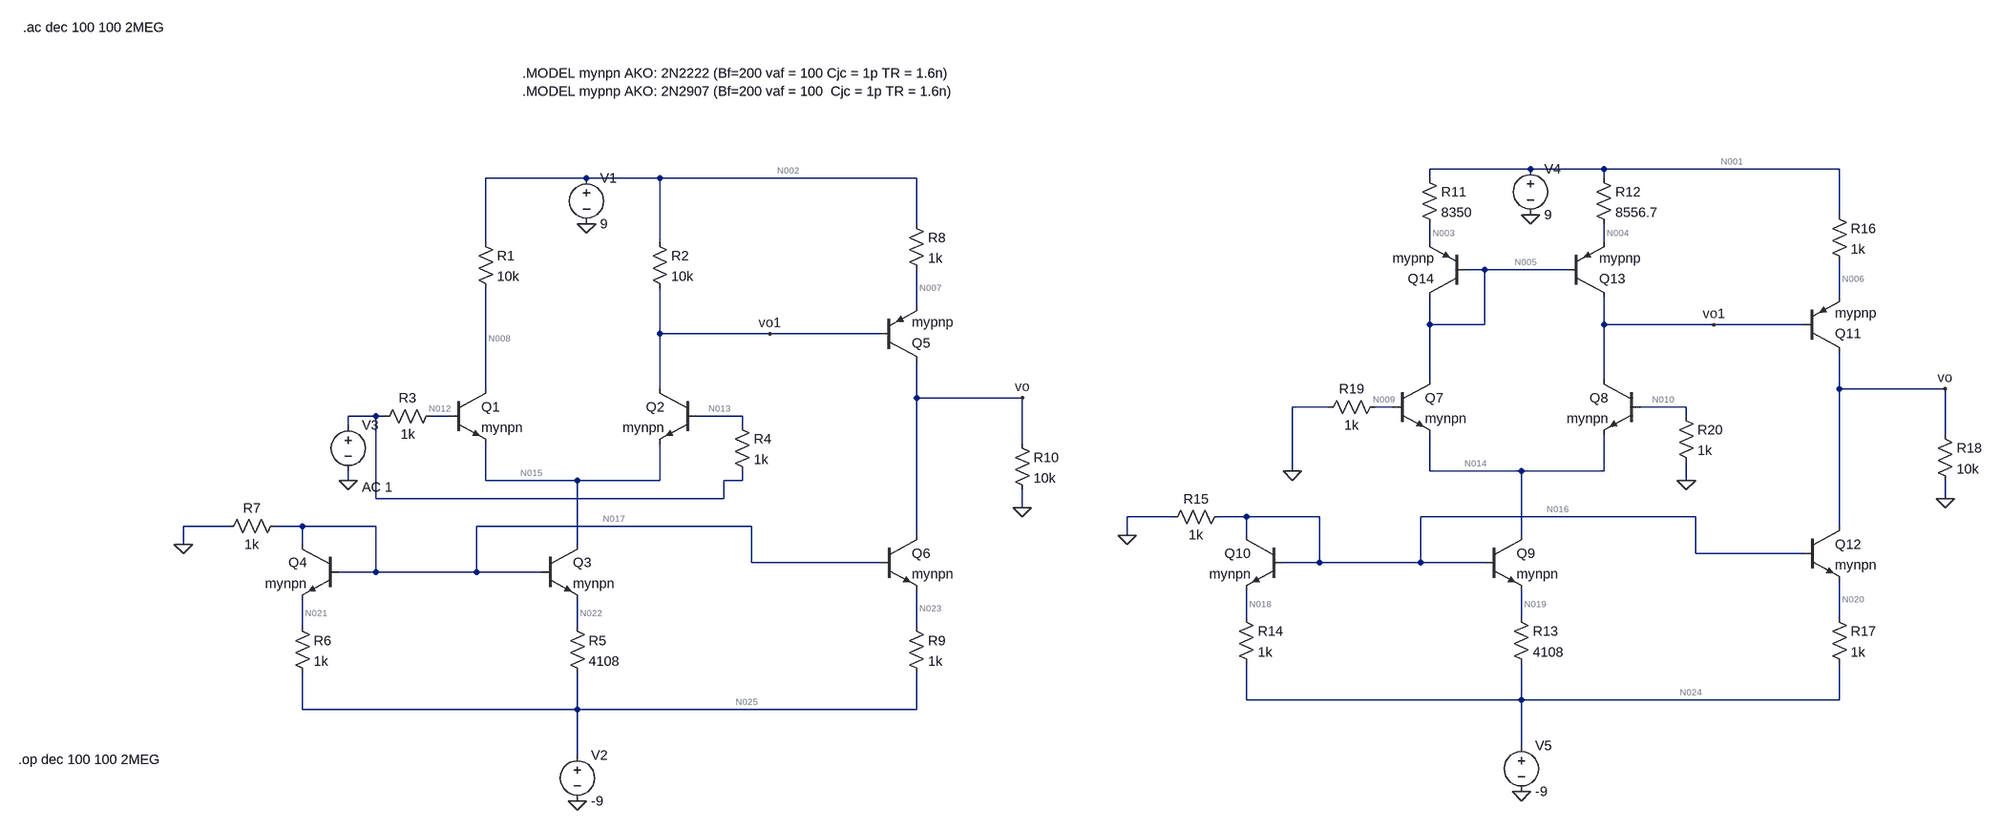
[diagram p0: schematic final que me tomaron.asc]
final que me tomaron.asc, the LTspice schematic file:
Version 4
SHEET 1 3460 1012
WIRE 2608 -112 2432 -112
WIRE 2736 -112 2608 -112
WIRE 3184 -112 2736 -112
WIRE 160 -96 -16 -96
WIRE 288 -96 160 -96
WIRE 736 -96 288 -96
WIRE 2432 -96 2432 -112
WIRE 2736 -96 2736 -112
WIRE 3184 -32 3184 -112
WIRE 736 -16 736 -96
WIRE -16 16 -16 -96
WIRE 288 16 288 -96
WIRE 2432 16 2432 -16
WIRE 2736 16 2736 -16
WIRE 2528 64 2496 64
WIRE 2672 64 2528 64
WIRE 3184 112 3184 48
WIRE 736 128 736 64
WIRE 2432 160 2432 112
WIRE 2528 160 2528 64
WIRE 2528 160 2432 160
WIRE 2736 160 2736 112
WIRE 2928 160 2736 160
WIRE 3120 160 2928 160
WIRE 288 176 288 96
WIRE 480 176 288 176
WIRE 672 176 480 176
WIRE 2432 256 2432 160
WIRE 2736 256 2736 160
WIRE -16 272 -16 96
WIRE 288 272 288 176
WIRE 3184 272 3184 208
WIRE 3392 272 3184 272
WIRE 736 288 736 224
WIRE 944 288 736 288
WIRE 2256 304 2192 304
WIRE 2368 304 2336 304
WIRE 2880 304 2800 304
WIRE -208 320 -256 320
WIRE -192 320 -208 320
WIRE -80 320 -112 320
WIRE 432 320 352 320
WIRE 2880 320 2880 304
WIRE -256 336 -256 320
WIRE 432 336 432 320
WIRE 3392 352 3392 272
WIRE 944 368 944 288
WIRE 2192 416 2192 304
WIRE 2432 416 2432 352
WIRE 2592 416 2432 416
WIRE 2736 416 2736 352
WIRE 2736 416 2592 416
WIRE -256 432 -256 416
WIRE -16 432 -16 368
WIRE 144 432 -16 432
WIRE 288 432 288 368
WIRE 288 432 144 432
WIRE 432 432 432 416
WIRE 432 432 400 432
WIRE 2880 432 2880 400
WIRE -208 464 -208 320
WIRE 400 464 400 432
WIRE 400 464 -208 464
WIRE 3392 464 3392 432
WIRE 944 480 944 448
WIRE 1984 496 1904 496
WIRE 2112 496 2064 496
WIRE 2240 496 2112 496
WIRE 2896 496 2416 496
WIRE -464 512 -544 512
WIRE -336 512 -384 512
WIRE -208 512 -336 512
WIRE 448 512 -32 512
WIRE 3184 512 3184 272
WIRE 736 528 736 288
WIRE 1904 528 1904 496
WIRE 2112 528 2112 496
WIRE 2592 528 2592 416
WIRE -544 544 -544 512
WIRE -336 544 -336 512
WIRE 144 544 144 432
WIRE 2896 560 2896 496
WIRE 3120 560 2896 560
WIRE 448 576 448 512
WIRE 672 576 448 576
WIRE 2240 576 2240 496
WIRE 2240 576 2176 576
WIRE 2416 576 2416 496
WIRE 2416 576 2240 576
WIRE 2528 576 2416 576
WIRE -208 592 -208 512
WIRE -208 592 -272 592
WIRE -32 592 -32 512
WIRE -32 592 -208 592
WIRE 80 592 -32 592
WIRE 2112 672 2112 624
WIRE 2592 672 2592 624
WIRE 3184 672 3184 608
WIRE -336 688 -336 640
WIRE 144 688 144 640
WIRE 736 688 736 624
WIRE 2112 816 2112 752
WIRE 2592 816 2592 752
WIRE 2592 816 2112 816
WIRE 3184 816 3184 752
WIRE 3184 816 2592 816
WIRE -336 832 -336 768
WIRE 144 832 144 768
WIRE 144 832 -336 832
WIRE 736 832 736 768
WIRE 736 832 144 832
WIRE 2592 896 2592 816
WIRE 144 912 144 832
FLAG 144 992 0
FLAG 160 -16 0
FLAG -544 544 0
FLAG 944 480 0
FLAG -256 432 0
FLAG 480 176 vo1
FLAG 944 288 vo
FLAG 2592 976 0
FLAG 2608 -32 0
FLAG 1904 528 0
FLAG 3392 464 0
FLAG 2192 416 0
FLAG 2880 432 0
FLAG 2928 160 vo1
FLAG 3392 272 vo
DATAFLAG 304 176 ""
DATAFLAG 736 288 ""
DATAFLAG 624 176 "$-V(N002)"
DATAFLAG 2752 160 ""
DATAFLAG 3184 272 ""
DATAFLAG 2432 144 ""
SYMBOL res -32 0 R0
SYMATTR InstName R1
SYMATTR Value 10k
SYMBOL res 272 0 R0
SYMATTR InstName R2
SYMATTR Value 10k
SYMBOL npn -80 272 R0
SYMATTR InstName Q1
SYMATTR Value mynpn
SYMBOL npn 352 272 M0
SYMATTR InstName Q2
SYMATTR Value mynpn
SYMBOL voltage 160 -112 R0
WINDOW 123 0 0 Left 0
WINDOW 39 0 0 Left 0
SYMATTR InstName V1
SYMATTR Value 9
SYMBOL npn 80 544 R0
SYMATTR InstName Q3
SYMATTR Value mynpn
SYMBOL res 128 672 R0
SYMATTR InstName R5
SYMATTR Value 4108
SYMBOL voltage 144 896 R0
WINDOW 123 0 0 Left 0
WINDOW 39 0 0 Left 0
SYMATTR InstName V2
SYMATTR Value -9
SYMBOL npn -272 544 M0
SYMATTR InstName Q4
SYMATTR Value mynpn
SYMBOL res -352 672 R0
SYMATTR InstName R6
SYMATTR Value 1k
SYMBOL res -368 496 R90
WINDOW 0 0 56 VBottom 2
WINDOW 3 32 56 VTop 2
SYMATTR InstName R7
SYMATTR Value 1k
SYMBOL pnp 672 224 M180
SYMATTR InstName Q5
SYMATTR Value mypnp
SYMBOL res 720 -32 R0
SYMATTR InstName R8
SYMATTR Value 1k
SYMBOL npn 672 528 R0
SYMATTR InstName Q6
SYMATTR Value mynpn
SYMBOL res 720 672 R0
SYMATTR InstName R9
SYMATTR Value 1k
SYMBOL res 928 352 R0
SYMATTR InstName R10
SYMATTR Value 10k
SYMBOL voltage -256 320 R0
WINDOW 123 24 124 Left 2
WINDOW 39 0 0 Left 0
SYMATTR Value2 AC 1
SYMATTR InstName V3
SYMATTR Value ""
SYMBOL res -96 304 R90
WINDOW 0 0 56 VBottom 2
WINDOW 3 32 56 VTop 2
SYMATTR InstName R3
SYMATTR Value 1k
SYMBOL res 416 320 R0
SYMATTR InstName R4
SYMATTR Value 1k
SYMBOL npn 2368 256 R0
SYMATTR InstName Q7
SYMATTR Value mynpn
SYMBOL npn 2800 256 M0
SYMATTR InstName Q8
SYMATTR Value mynpn
SYMBOL voltage 2608 -128 R0
WINDOW 123 0 0 Left 0
WINDOW 39 0 0 Left 0
SYMATTR InstName V4
SYMATTR Value 9
SYMBOL npn 2528 528 R0
SYMATTR InstName Q9
SYMATTR Value mynpn
SYMBOL res 2576 656 R0
SYMATTR InstName R13
SYMATTR Value 4108
SYMBOL voltage 2592 880 R0
WINDOW 123 0 0 Left 0
WINDOW 39 0 0 Left 0
SYMATTR InstName V5
SYMATTR Value -9
SYMBOL npn 2176 528 M0
SYMATTR InstName Q10
SYMATTR Value mynpn
SYMBOL res 2096 656 R0
SYMATTR InstName R14
SYMATTR Value 1k
SYMBOL res 2080 480 R90
WINDOW 0 0 56 VBottom 2
WINDOW 3 32 56 VTop 2
SYMATTR InstName R15
SYMATTR Value 1k
SYMBOL pnp 3120 208 M180
SYMATTR InstName Q11
SYMATTR Value mypnp
SYMBOL res 3168 -48 R0
SYMATTR InstName R16
SYMATTR Value 1k
SYMBOL npn 3120 512 R0
SYMATTR InstName Q12
SYMATTR Value mynpn
SYMBOL res 3168 656 R0
SYMATTR InstName R17
SYMATTR Value 1k
SYMBOL res 3376 336 R0
SYMATTR InstName R18
SYMATTR Value 10k
SYMBOL res 2352 288 R90
WINDOW 0 0 56 VBottom 2
WINDOW 3 32 56 VTop 2
SYMATTR InstName R19
SYMATTR Value 1k
SYMBOL res 2864 304 R0
SYMATTR InstName R20
SYMATTR Value 1k
SYMBOL res 2416 -112 R0
SYMATTR InstName R11
SYMATTR Value 8350
SYMBOL res 2720 -112 R0
SYMATTR InstName R12
SYMATTR Value 8556.7
SYMBOL pnp 2672 112 M180
SYMATTR InstName Q13
SYMATTR Value mypnp
SYMBOL pnp 2496 112 R180
SYMATTR InstName Q14
SYMATTR Value mypnp
TEXT -832 920 Left 2 !.op dec 100 100 2MEG
TEXT 48 -328 Left 2 !.MODEL mynpn AKO: 2N2222 (Bf=200 vaf = 100 Cjc = 1p TR = 1.6n)
TEXT 48 -296 Left 2 !.MODEL mypnp AKO: 2N2907 (Bf=200 vaf = 100  Cjc = 1p TR = 1.6n)
TEXT -824 -408 Left 2 !.ac dec 100 100 2MEG

The netlist it stands for:
* final que me tomaron.asc
R1 N002 N008 10k
R2 N002 vo1 10k
Q1 N008 N012 N015 0 mynpn
Q2 vo1 N013 N015 0 mynpn
V1 N002 0 9
Q3 N015 N017 N022 0 mynpn
R5 N022 N025 4108
V2 N025 0 -9
Q4 N017 N017 N021 0 mynpn
R6 N021 N025 1k
R7 N017 0 1k
Q5 vo vo1 N007 0 mypnp
R8 N002 N007 1k
Q6 vo N017 N023 0 mynpn
R9 N023 N025 1k
R10 vo 0 10k
V3 N011 0 AC 1
R3 N012 N011 1k
R4 N013 N011 1k
Q7 N005 N009 N014 0 mynpn
Q8 vo1 N010 N014 0 mynpn
V4 N001 0 9
Q9 N014 N016 N019 0 mynpn
R13 N019 N024 4108
V5 N024 0 -9
Q10 N016 N016 N018 0 mynpn
R14 N018 N024 1k
R15 N016 0 1k
Q11 vo vo1 N006 0 mypnp
R16 N001 N006 1k
Q12 vo N016 N020 0 mynpn
R17 N020 N024 1k
R18 vo 0 10k
R19 N009 0 1k
R20 N010 0 1k
R11 N001 N003 8350
R12 N001 N004 8556.7
Q13 vo1 N005 N004 0 mypnp
Q14 N005 N005 N003 0 mypnp
.model NPN NPN
.model PNP PNP
.lib standard.bjt
.op dec 100 100 2MEG
.MODEL mynpn AKO: 2N2222 (Bf=200 vaf = 100 Cjc = 1p TR = 1.6n)
.MODEL mypnp AKO: 2N2907 (Bf=200 vaf = 100  Cjc = 1p TR = 1.6n)
.ac dec 100 100 2MEG
.backanno
.end

* Results of the author's LTspice run, read from the files saved beside the schematic
* Operating Point, zero values left out:
*   V(n002) = 9 V
*   V(n008) = 3.967 V
*   V(vo1) = 4.186 V
*   V(n012) = -2.424 mV
*   V(n015) = -638.9 mV
*   V(n013) = -2.424 mV
*   V(n017) = -4.166 V
*   V(n022) = -4.821 V
*   V(n025) = -9 V
*   V(n021) = -4.859 V
*   V(vo) = -191.8 mV
*   V(n007) = 4.877 V
*   V(n023) = -4.858 V
*   V(n005) = 4.177 V
*   V(n009) = -2.422 mV
*   V(n014) = -638.9 mV
*   V(n010) = -2.422 mV
*   V(n001) = 9 V
*   V(n016) = -4.166 V
*   V(n019) = -4.821 V
*   V(n024) = -9 V
*   V(n018) = -4.859 V
*   V(n006) = 4.877 V
*   V(n020) = -4.858 V
*   V(n003) = 4.814 V
*   V(n004) = 4.813 V
*   Ic(Q1) = 503.3 µA
*   Ib(Q1) = 2.424 µA
*   Ie(Q1) = -505.7 µA
*   Ic(Q2) = 504.3 µA
*   Ib(Q2) = 2.424 µA
*   Ie(Q2) = -506.7 µA
*   Ic(Q3) = 1.012 mA
*   Ib(Q3) = 4.906 µA
*   Ie(Q3) = -1.017 mA
*   Ic(Q4) = 4.12 mA
*   Ib(Q4) = 20.88 µA
*   Ie(Q4) = -4.141 mA
*   Ic(Q6) = 4.122 mA
*   Ib(Q6) = 20.08 µA
*   Ie(Q6) = -4.142 mA
*   Ic(Q7) = 503.8 µA
*   Ib(Q7) = 2.422 µA
*   Ie(Q7) = -506.2 µA
*   Ic(Q8) = 503.8 µA
*   Ib(Q8) = 2.422 µA
*   Ie(Q8) = -506.2 µA
*   Ic(Q9) = 1.012 mA
*   Ib(Q9) = 4.906 µA
*   Ie(Q9) = -1.017 mA
*   Ic(Q10) = 4.12 mA
*   Ib(Q10) = 20.88 µA
*   Ie(Q10) = -4.141 mA
*   Ic(Q12) = 4.122 mA
*   Ib(Q12) = 20.08 µA
*   Ie(Q12) = -4.142 mA
*   Ic(Q5) = -4.103 mA
*   Ib(Q5) = -19.91 µA
*   Ie(Q5) = 4.123 mA
*   Ic(Q11) = -4.103 mA
*   Ib(Q11) = -19.91 µA
*   Ie(Q11) = 4.123 mA
*   Ic(Q13) = -486.9 µA
*   Ib(Q13) = -2.438 µA
*   Ie(Q13) = 489.3 µA
*   Ic(Q14) = -498.8 µA
*   Ib(Q14) = -2.498 µA
*   Ie(Q14) = 501.3 µA
*   I(R1) = 503.3 µA
*   I(R2) = 481.4 µA
*   I(R5) = 1.017 mA
*   I(R6) = 4.141 mA
*   I(R7) = -4.166 mA
*   I(R8) = 4.123 mA
*   I(R9) = 4.142 mA
*   I(R10) = -19.18 µA
*   I(R3) = -2.424 µA
*   I(R4) = -2.424 µA
*   I(R13) = 1.017 mA
*   I(R14) = 4.141 mA
*   I(R15) = -4.166 mA
*   I(R16) = 4.123 mA
*   I(R17) = 4.142 mA
*   I(R18) = -19.18 µA
*   I(R19) = -2.422 µA
*   I(R20) = -2.422 µA
*   I(R11) = 501.3 µA
*   I(R12) = 489.3 µA
*   I(V1) = -5.107 mA
*   I(V2) = 9.3 mA
*   I(V3) = -4.848 µA
*   I(V4) = -5.113 mA
*   I(V5) = 9.3 mA
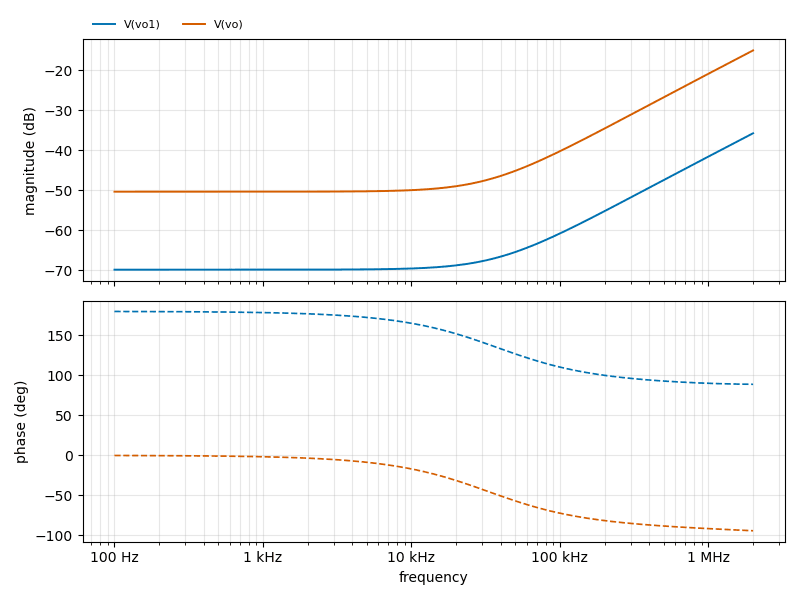
[diagram p1: AC Analysis of final que me tomaron.asc, plotted from the saved traces]
* AC Analysis, 1 run:
*   V(vo1): -69.85 dB at 100 Hz, -35.76 dB at 2 MHz, peak -35.76 dB at 2 MHz, 3 dB below the peak at 1.399 MHz
*   V(vo): -50.37 dB at 100 Hz, -15.06 dB at 2 MHz, peak -15.06 dB at 2 MHz, 3 dB below the peak at 1.399 MHz
* From the log:
*   Semiconductor Device Operating Points:
*                           --- Bipolar Transistors ---
*   Name:       q1          q2          q3          q4          q6
*   Model:     mynpn       mynpn       mynpn       mynpn       mynpn
*   Ib:       2.42e-06    2.42e-06    4.91e-06    2.09e-05    2.01e-05
*   Ic:       5.03e-04    5.04e-04    1.01e-03    4.12e-03    4.12e-03
*   Vbe:      6.37e-01    6.37e-01    6.55e-01    6.93e-01    6.92e-01
*   Vbc:     -3.97e+00   -4.19e+00   -3.53e+00    0.00e+00   -3.97e+00
*   Vce:      4.61e+00    4.82e+00    4.18e+00    6.93e-01    4.67e+00
*   BetaDC:   2.08e+02    2.08e+02    2.06e+02    1.97e+02    2.05e+02
*   Gm:       1.94e-02    1.95e-02    3.90e-02    1.57e-01    1.57e-01
*   Rpi:      1.07e+04    1.07e+04    5.27e+03    1.24e+03    1.29e+03
*   Rx:       1.00e+01    1.00e+01    1.00e+01    1.00e+01    1.00e+01
*   Ro:       2.07e+05    2.07e+05    1.02e+05    2.43e+04    2.52e+04
*   Cbe:      4.64e-11    4.64e-11    5.48e-11    1.03e-10    1.03e-10
*   Cbc:      5.45e-13    5.37e-13    5.63e-13    1.00e-12    5.45e-13
*   Cjs:      0.00e+00    0.00e+00    0.00e+00    0.00e+00    0.00e+00
*   BetaAC:   2.07e+02    2.08e+02    2.06e+02    1.95e+02    2.03e+02
*   Cbx:      0.00e+00    0.00e+00    0.00e+00    0.00e+00    0.00e+00
*   Ft:       6.58e+07    6.59e+07    1.12e+08    2.40e+08    2.42e+08
*   Name:       q7          q8          q9          q10         q12
*   Model:     mynpn       mynpn       mynpn       mynpn       mynpn
*   Ib:       2.42e-06    2.42e-06    4.91e-06    2.09e-05    2.01e-05
*   Ic:       5.04e-04    5.04e-04    1.01e-03    4.12e-03    4.12e-03
*   Vbe:      6.36e-01    6.36e-01    6.55e-01    6.93e-01    6.92e-01
*   Vbc:     -4.18e+00   -4.19e+00   -3.53e+00    0.00e+00   -3.97e+00
*   Vce:      4.82e+00    4.82e+00    4.18e+00    6.93e-01    4.67e+00
*   BetaDC:   2.08e+02    2.08e+02    2.06e+02    1.97e+02    2.05e+02
*   Gm:       1.94e-02    1.94e-02    3.90e-02    1.57e-01    1.57e-01
*   Rpi:      1.07e+04    1.07e+04    5.27e+03    1.24e+03    1.29e+03
*   Rx:       1.00e+01    1.00e+01    1.00e+01    1.00e+01    1.00e+01
*   Ro:       2.07e+05    2.07e+05    1.02e+05    2.43e+04    2.52e+04
*   Cbe:      4.64e-11    4.64e-11    5.48e-11    0.00e+00    0.00e+00
*   Cbc:      5.37e-13    5.37e-13    5.63e-13    0.00e+00    0.00e+00
*   Cjs:      0.00e+00    0.00e+00    0.00e+00    0.00e+00    0.00e+00
*   BetaAC:   2.08e+02    2.08e+02    2.06e+02    1.95e+02    2.03e+02
*   Cbx:      0.00e+00    0.00e+00    0.00e+00    0.00e+00    0.00e+00
*   Ft:       6.59e+07    6.59e+07    1.12e+08    0.00e+00    0.00e+00
*   Name:       q5          q11         q13         q14
*   Model:     mypnp       mypnp       mypnp       mypnp
*   Ib:      -1.99e-05   -1.99e-05   -2.44e-06   -2.50e-06
*   Ic:      -4.10e-03   -4.10e-03   -4.87e-04   -4.99e-04
*   Vbe:     -6.92e-01   -6.92e-01   -6.37e-01   -6.37e-01
*   Vbc:      4.38e+00    4.38e+00   -8.92e-03    0.00e+00
*   Vce:     -5.07e+00   -5.07e+00   -6.28e-01   -6.37e-01
*   BetaDC:   2.06e+02    2.06e+02    2.00e+02    2.00e+02
*   Gm:       1.57e-01    1.57e-01    1.88e-02    1.92e-02
*   Rpi:      1.30e+03    1.30e+03    1.06e+04    1.04e+04
*   Rx:       1.00e+01    1.00e+01    1.00e+01    1.00e+01
*   Ro:       2.54e+04    2.54e+04    2.05e+05    2.00e+05
*   Cbe:      0.00e+00    0.00e+00    0.00e+00    0.00e+00
*   Cbc:      0.00e+00    0.00e+00    0.00e+00    0.00e+00
*   Cjs:      0.00e+00    0.00e+00    0.00e+00    0.00e+00
*   BetaAC:   2.03e+02    2.03e+02    1.99e+02    1.99e+02
*   Cbx:      0.00e+00    0.00e+00    0.00e+00    0.00e+00
*   Ft:       0.00e+00    0.00e+00    0.00e+00    0.00e+00